# Altium schematic sheet Connectors.SchDoc: Connectors
size OrCAD A; DocumentNumber: LM-003; Revision: 3.0; SheetNumber: 5; SheetTotal: 11
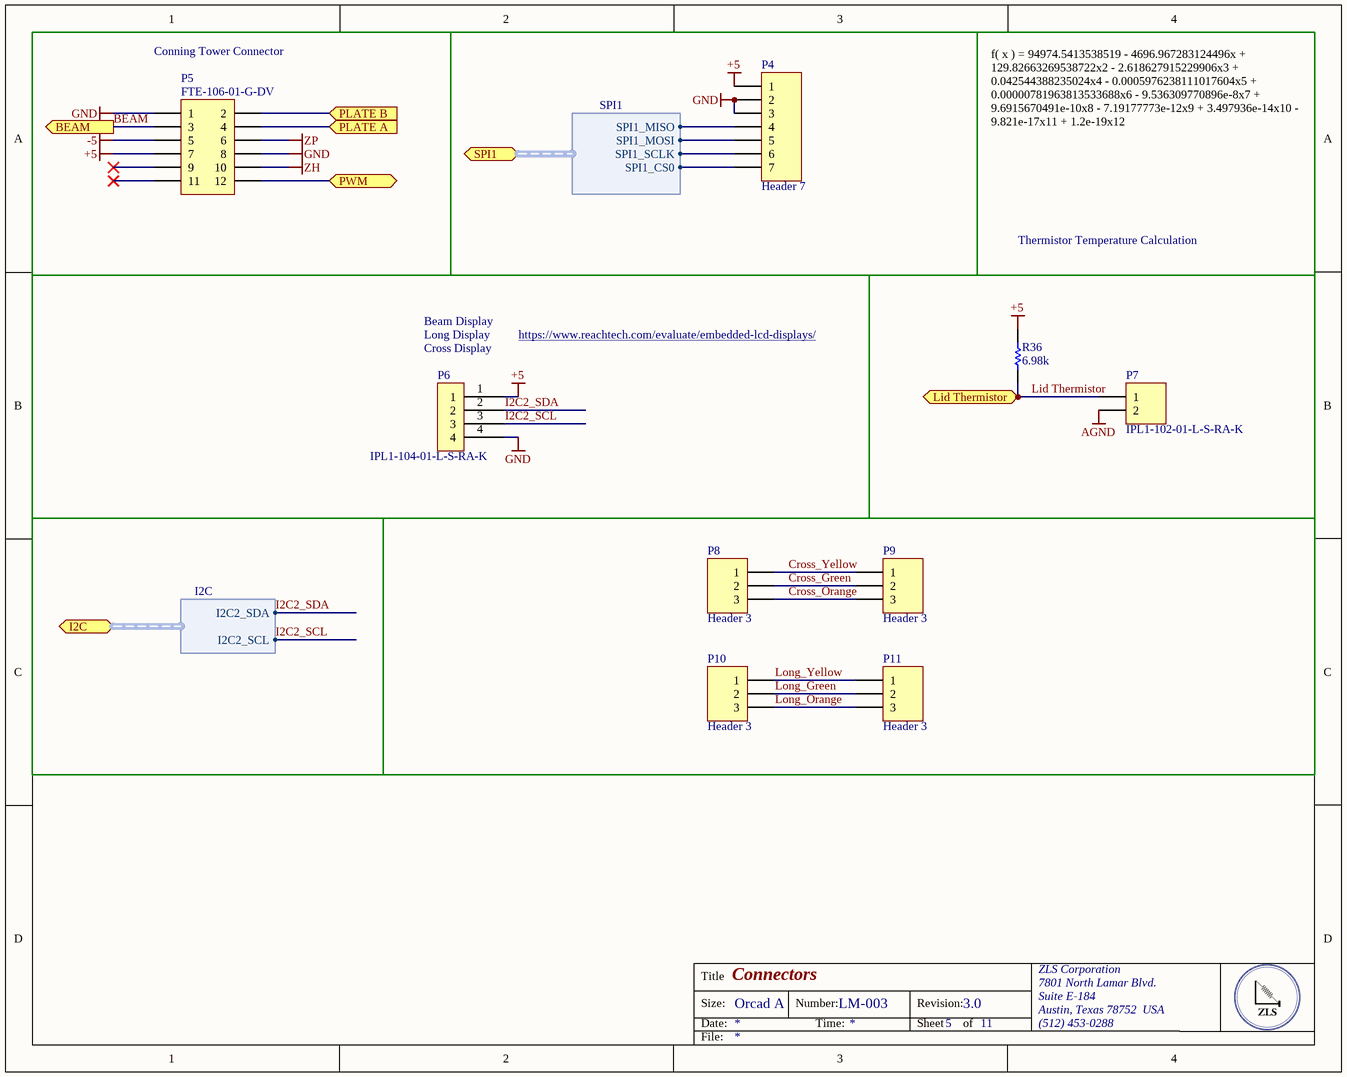
[diagram p0: Connectors.SchDoc]

## Parts
P4  Header 7  [HDR1X7]
P5  FTE-106-01-G-DV  [FTSH-106-01]
P6  IPL1-104-01-L-S-RA-K  [IPL1-104-01]
P7  IPL1-102-01-L-S-RA-K  [IPL1-102-01]
P8  Header 3  [HDR1X3]
P9  Header 3  [HDR1X3]
P10  Header 3  [HDR1X3]
P11  Header 3  [HDR1X3]
R36  Resistance (Ohms): 6.98k  [RESC0805(2012)_N]  (hidden comment: 6K98 1% 0805(2012))

## Blocks framed on the sheet
Conning Tower Connector: P5

## Ports
BEAM (out), I2C (harness I2C), Lid Thermistor, PLATE A (in), PLATE B (in), PWM, SPI1 (harness SPI1)

## Harnesses
I2C: I2C2_SDA, I2C2_SCL
SPI1: SPI1_CS0, SPI1_MISO, SPI1_MOSI, SPI1_SCLK

## Nets
+5: P4.1 P5.7 P6.1 R36.2
-5: P5.5
AGND: P7.2
GND: P4.2 P4.3 P5.1 P5.8 P6.4
ZH: P5.10
ZP: P5.6
BEAM: P5.3 ; port BEAM
Cross_Green: P8.2 P9.2
Cross_Orange: P8.3 P9.3
Cross_Yellow: P8.1 P9.1
I2C2_SCL: P6.3 ; port I2C.I2C2_SCL
I2C2_SDA: P6.2 ; port I2C.I2C2_SDA
Lid Thermistor: P7.1 R36.1 ; port Lid Thermistor
Long_Green: P10.2 P11.2
Long_Orange: P10.3 P11.3
Long_Yellow: P10.1 P11.1
PLATE A: P5.4 ; port PLATE A
PLATE B: P5.2 ; port PLATE B
PWM: P5.12 ; port PWM
NetP4_4: P4.4 ; port SPI1.SPI1_MISO
NetP4_5: P4.5 ; port SPI1.SPI1_MOSI
NetP4_6: P4.6 ; port SPI1.SPI1_SCLK
NetP4_7: P4.7 ; port SPI1.SPI1_CS0

Not connected (* = marked no-connect by the designer): P5 9* 11*

## Notes on the sheet
- f( x ) = 94974.5413538519 - 4696.967283124496x + 129.82663269538722x2 - 2.618627915229906x3 + 0.042544388235024x4 - 0.0005976238111017604x5 + 0.00000781963813533688x6 - 9.536309770896e-8x7 + 9.6915670491e-10x8 - 7.19177773e-12x9 + 3.497936e-14x10 - 9.821e-17x11 + 1.2e-19x12
- Thermistor Temperature Calculation
- (near P6) Cross Display
- Long Display
- Beam Display
- https://www.reachtech.com/evaluate/embedded-lcd-displays/
- Title
- Size:
- Date:
- Orcad A
- Number:
- Time:
- Revision:
- Sheet
- of
- ZLS Corporation
- 7801 North Lamar Blvd.
- Suite E-184
- Austin, Texas 78752  USA
- (512) 453-0288
- File:

## Library data of the parts
P4 = Header 7: Header, 7-Pin; LatestRevisionDate: 17-Jul-2002; LatestRevisionNote: Re-released for DXP Platform.; Publisher: Altium Limited
P5 = Header 6X2: Header, 6-Pin, Dual row; Manufacturer: Samtec; Connector Type: Male Header; No. of positions: 6; No. of Rows: 2; Pitch: 0.8mm; Number of Positions: 12; Number of Positions Loaded: All; Row Spacing: 0.047" (1.20mm); Molding Height Above Board: 0.067" (1.70mm); Pitch Spacing: 0.8; Contact Termination: Surface Mount Vertical; LatestRevisionDate: 17-Jul-2002; LatestRevisionNote: Re-released for DXP Platform.; Publisher: Altium Limited; Supplier 1: Newark; ComponentLink1URL: http://www.samtec.com/; ComponentLink2URL: http://www.samtec.com/technical-specifications/Default.aspx?SeriesMaster=FTE; Mounting Technology: Surface Mount; Supplier 2: Digi-Key; Manufacturer Part Number: FTE-106-01-G-DV; RoHS: RoHS Compliant; Category: Connectors, Interconnects; Stock 2: 0; Pricing 2: 1=7.49, 10=6.49, 100=5.4911, 500=4.36794, 1000=3.55676, 5000=3.24476, 10000=3.11996 (USD); Packaging: Tube; Number of Rows: 2; Height Stacking (Mating): -; Contact Mating Length: 0.075" (1.90mm); Mounting Type: Surface Mount; Termination: Solder; Contact Finish: Gold; Contact Finish Thickness: 10µin (0.25µm); Features: -; Color: Black; ComponentLink3URL: http://www.samtec.com/documents/webfiles/pdf/FTE_SM.PDF; ComponentLink3Description: http://www.samtec.com/documents/webfiles/pdf/FTE_SM.PDF; Stock 1: 0; Pricing 1: 1=3.26, 10=2.85, 100=2.43, 500=2, 1000=1.72, 5000=1.55, 10000=1.48 (USD); Series: FTE; No. of Contacts: 12; Gender: Header; Contact Plating: Gold; Contact Material: Phosphor Bronze; ComponentLink4URL: http://www.samtec.com/ftppub/pdf/FTE_SM.PDF; ComponentLink4Description: http://www.samtec.com/ftppub/pdf/FTE_SM.PDF; Supplier Part Number 1: 11P4479; Supplier Part Number 2: SAM1144-06-ND
P6 = 53047-0410: .100 TERMINAL ASSY; Manufacturer 1: Samtec Inc.; Category 1: Connectors, Interconnects; Connector Type: Header; Pitch - Mating: 0.100" (2.54mm); Style: Board to Cable/Wire; Shrouding: Shrouded - 4 Wall; Number of Positions: 4; Number of Positions Loaded: All; Contact Length - Mating: 0.215" (5.46mm); Contact Length - Post: 0.085" (2.16mm); Material Flammability Rating: UL94 V-0; Voltage Rating: 675VAC, 954VDC; Supplier 1: Digi-Key; Supplier Part Number 1: SAM9597-ND; Manufacturer Part Number 1: IPL1-104-01-L-S-RA-K; RoHS 1: RoHS Compliant; Description 1: .100 TERMINAL ASSY; Stock 1: 100; Pricing 1: 1=2.53, 10=2.424, 25=2.222, 50=2.121, 100=2.02, 250=1.76752, 500=1.717, 1000=1.4645, 2500=1.3635 (USD); Packaging: Tube; Part Status: Active; Contact Type: Male Pin; Number of Rows: 1; Row Spacing - Mating: -; Mounting Type: Through Hole, Right Angle; Termination: Solder; Fastening Type: Locking Ramp; Overall Contact Length: -; Insulation Height: 0.240" (6.10mm); Contact Shape: Square; Contact Finish - Mating: Gold; Contact Finish Thickness - Mating: 10µin (0.25µm); Contact Finish - Post: Tin; Contact Material: Phosphor Bronze; Insulation Material: Liquid Crystal Polymer (LCP); Features: -; Operating Temperature: -55°C ~ 125°C; Ingress Protection: -; Insulation Color: Natural; Current Rating: -; Mated Stacking Heights: -; Contact Finish Thickness - Post: -; Applications: -; ComponentLink1URL: http://suddendocs.samtec.com/prints/ipl1-1xx-xx-xxx-s-xx-x-xx-mkt.pdf; ComponentLink1Description: http://suddendocs.samtec.com/prints/ipl1-1xx-xx-xxx-s-xx-x-xx-mkt.pdf
P7 = Header 2H: CONN SHROUDED PWR HEADER 2POS; Manufacturer 1: Samtec Inc.; Category 1: Connectors, Interconnects; Pitch - Mating: 0.100" (2.54mm); Style: Board to Cable/Wire; Shrouding: Shrouded - 4 Wall; Number of Positions: 2; Number of Positions Loaded: All; Contact Length - Mating: 0.215" (5.46mm); Contact Length - Post: 0.085" (2.16mm); Material Flammability Rating: UL94 V-0; Voltage Rating: 675VAC, 954VDC; Supplier 1: Digi-Key; Supplier Part Number 1: SAM10566-ND; Manufacturer Part Number 1: IPL1-102-01-L-S-RA-K; RoHS 1: RoHS Compliant; Description 1: CONN SHROUDED PWR HEADER 2POS; Stock 1: 0; Pricing 1: 1=2.44, 10=2.217, 25=2.0816, 50=1.991, 100=1.9005, 250=1.71952, 500=1.58376, 1000=1.3575, 2500=1.267 (USD); Packaging: Tube; Part Status: Active; Connector Type: Header; Contact Type: Male Pin; Number of Rows: 1; Row Spacing - Mating: -; Mounting Type: Through Hole, Right Angle; Termination: Solder; Fastening Type: Locking Ramp; Overall Contact Length: -; Insulation Height: 0.240" (6.10mm); Contact Shape: Square; Contact Finish - Mating: Gold; Contact Finish Thickness - Mating: 10µin (0.25µm); Contact Finish - Post: Tin; Contact Material: Phosphor Bronze; Insulation Material: Liquid Crystal Polymer (LCP); Features: -; Operating Temperature: -55°C ~ 125°C; Ingress Protection: -; Insulation Color: Natural; Current Rating: -; Mated Stacking Heights: -; Contact Finish Thickness - Post: -; Applications: -; ComponentLink1URL: http://suddendocs.samtec.com/prints/ipl1-1xx-xx-xxx-s-xx-x-xx-mkt.pdf; ComponentLink1Description: http://suddendocs.samtec.com/prints/ipl1-1xx-xx-xxx-s-xx-x-xx-mkt.pdf
P8-P11 = Header 3: Header, 3-Pin; LatestRevisionDate: 17-Jul-2002; LatestRevisionNote: Re-released for DXP Platform.; Publisher: Altium Limited
R36 = CMP-1013-00606-1: 6K98 0.125W 1% 0805 (2012 Metric)  SMD; Manufacturer: Vishay Dale; Manufacturer Part Number: CRCW08056K98FKEA; Power (Watts): 0.125W, 1/8W; Temperature Coefficient: ±100ppm/°C; Supplier 1: Digi-Key; Supplier Part Number 1: 541-6.98KCCT-ND; RoHS: RoHS Compliant; Category: Resistors; Stock 1: 34245; Pricing 1: 1=0.1, 10=0.044, 100=0.0178, 1000=0.00802, 2500=0.00696 (USD); Packaging: Cut Tape (CT); Part Status: Active; Tolerance: ±1%; Composition: Thick Film; Features: Automotive AEC-Q200; Operating Temperature: -55°C ~ 155°C; Package / Case: 0805 (2012 Metric); Supplier Device Package: 0805; Size / Dimension: 0.079" L x 0.049" W (2.00mm x 1.25mm); Height - Seated (Max): 0.020" (0.50mm); Failure Rate: -; ComponentLink1URL: http://www.vishay.com/docs/20035/dcrcwe3.pdf; ComponentLink1Description: http://www.vishay.com/docs/20035/dcrcwe3.pdf